# EasyEDA Pro project MasterCtrl.eprj, board MasterPCB_RA
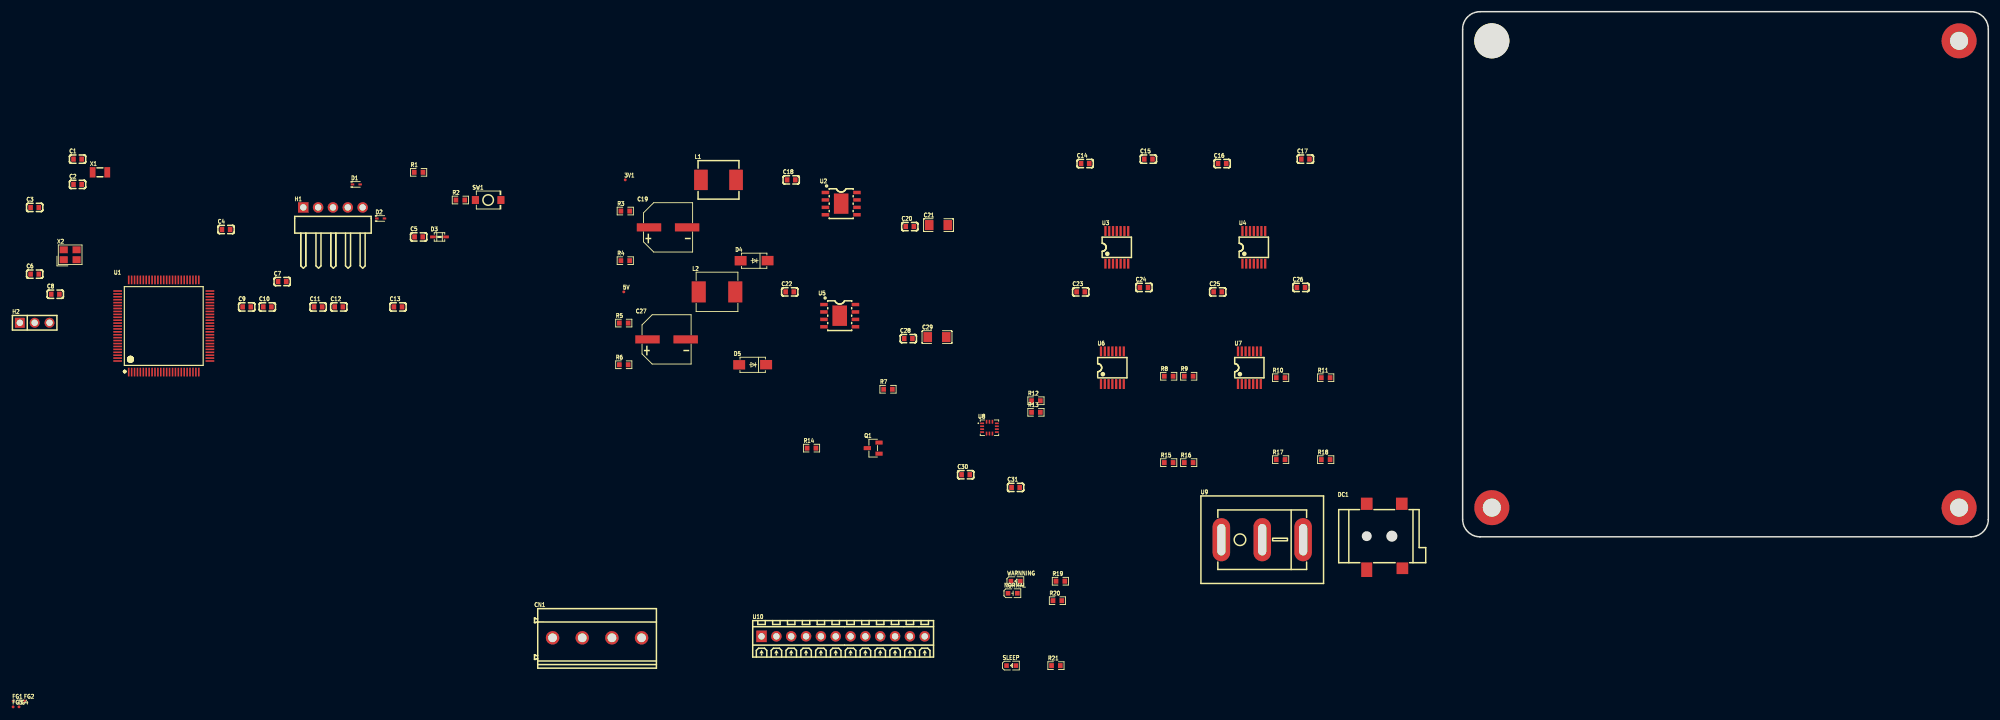
[diagram p10: board, top side]
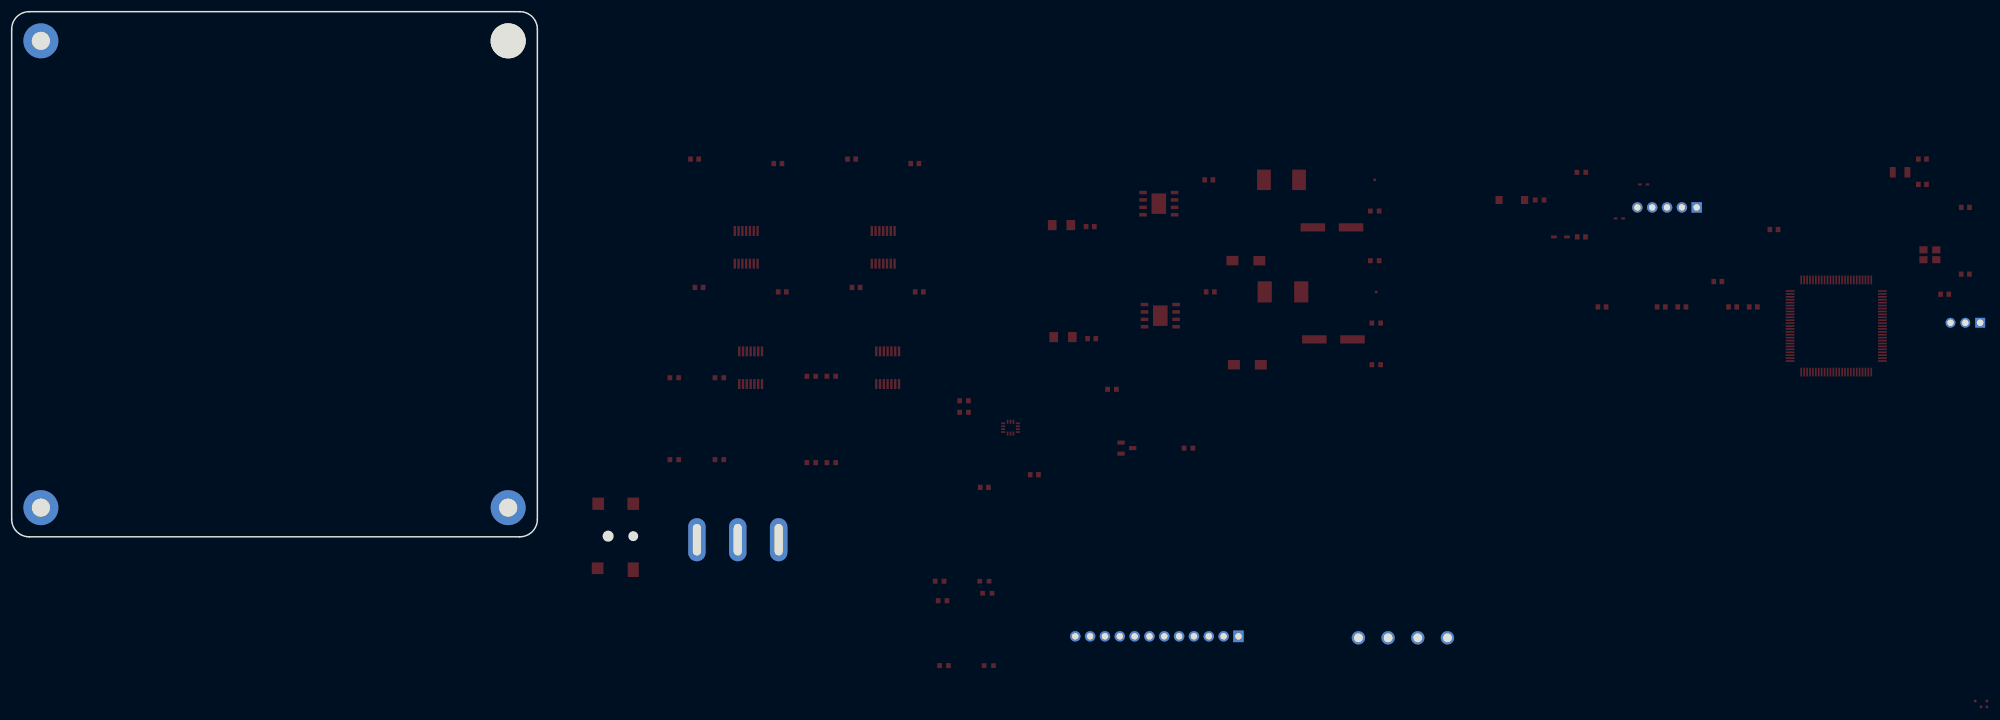
[diagram p11: board, bottom side, seen from below]

Outline 107.26 x 90.83 mm; copper layers: Top Layer, Bottom Layer. Coordinates in mm from the lower left corner of the outline.
Outline path: 17.26,87.83 17.26,3.83 arc(18.14,1.71) 20.26,0.83 104.26,0.83 arc(106.38,1.71) 107.26,3.83 107.26,87.83 arc(106.38,89.95) 104.26,90.83 20.26,90.83 arc(18.14,89.95) 17.26,87.83
Stack: Top Layer 0.035mm / Dielectric1 1.51mm FR4 er 4.5 / Bottom Layer 0.035mm

## Design rules (mm)
template: JLCPCB Capability(Two Layers Board)
spacing copperThickness1oz (default): track to track 0.102, other pairs 0.152 to 0.3
spacing copperThickness2oz: track to track 0.203, other pairs 0.152 to 0.3
track width copperThickness1oz (default): min 0.127, default 0.254, max 2.54
track width copperThickness2oz: min 0.203, default 0.254, max 2.54
differential pair differentialPair (default): width min 0.127, default 0.254, max 2.54; gap min 0.152, default 0.152
via viaSize (default): diameter min 0.5, default 0.61, max 10; hole min 0.3, default 0.305, max 6.3

## Placement (name value [footprint] x y rotation side)
3V1  -  [Test-Point-0.5mm]  -126.1 62.01 0 top
5V  -  [Test-Point-0.5mm]  -126.35 42.81 0 top
C1  20pF  [C0603]  -219.87 65.56 0 top
C2  20pF  [C0603]  -219.87 61.23 0 top
C3  20pF  [C0603]  -227.21 57.28 0 top
C4  100nF  [C0603]  -194.45 53.5 0 top
C5  1uF  [C0603]  -161.48 52.23 0 top
C6  20pF  [C0603]  -227.21 45.85 0 top
C7  100nF  [C0603]  -184.84 44.58 0 top
C8  100nF  [C0603]  -223.68 42.41 0 top
C9  100nF  [C0603]  -190.91 40.23 0 top
C10  100nF  [C0603]  -187.38 40.23 0 top
C11  100nF  [C0603]  -178.68 40.23 0 top
C12  100nF  [C0603]  -175.15 40.23 0 top
C13  10uF  [C0603]  -165.01 40.23 0 top
C14  100nF  [C0603]  -47.36 64.8 0 top
C15  100nF  [C0603]  -36.54 65.56 0 top
C16  100nF  [C0603]  -23.91 64.8 0 top
C17  100nF  [C0603]  -9.66 65.56 0 top
C18  10nF  [C0603]  -97.69 62.01 0 top
C19  220uF  [CAP-SMD_BD8.0-L8.3-W8.3-FD]  -118.77 53.87 0 top
C20  100nF  [C0603]  -77.38 54 0 top
C21  10uF  [C1206]  -72.47 54.25 0 top
C22  10nF  [C0603]  -97.94 42.81 0 top
C23  100nF  [C0603]  -48.13 42.81 0 top
C24  100nF  [C0603]  -37.3 43.57 0 top
C25  100nF  [C0603]  -24.67 42.81 0 top
C26  100nF  [C0603]  -10.42 43.57 0 top
C27  220uF  [CAP-SMD_BD8.0-L8.3-W8.3-FD]  -119.03 34.67 0 top
C28  100nF  [C0603]  -77.64 34.8 0 top
C29  10uF  [C1206]  -72.73 35.06 0 top
C30  100nF  [C0603]  -67.82 11.48 0 top
C31  100nF  [C0603]  -59.27 9.3 0 top
CN1  DB128V-5.08-4P-GN-S  [CONN-TH_4P-P5.08_DIBO_DB128V-5.08]  -130.93 -16.48 0 top
D1  RB521S30T1G  [SOD-523_L1.2-W0.8-LS1.6-RD]  -172.14 61.23 0 top
D2  RB521S30T1G  [SOD-523_L1.2-W0.8-LS1.6-RD]  -167.98 55.39 0 top
D3  PESD3V3L1BA-N  [SOD-323_L1.8-W1.3-LS2.5-BI]  -157.9 52.23 0 top
D4  SS54  [SMA_L4.3-W2.6-LS5.0-FD]  -104.04 48.16 0 top
D5  SS54  [SMA_L4.3-W2.6-LS5.0-FD]  -104.29 30.32 0 top
DC1  DC050-T  [DC-IN_DC050-T]  3.9 0.85 0 top
FG1  -  [Test-Point-0.5mm]  -230.9 -27.31 0 top
FG2  -  [Test-Point-0.5mm]  -228.9 -27.31 0 top
FG3  -  [Test-Point-0.5mm]  -230.9 -28.31 0 top
FG4  -  [Test-Point-0.5mm]  -229.9 -28.31 0 top
H1  PZ254R-11-05P  [HDR-TH_5P-P2.54-H-M-W10.4]  -176.14 57.28 0 top
H2  PZ254V-11-03P  [HDR-TH_3P-P2.54-V-M]  -227.21 37.52 0 top
L1  10uH  [IND-SMD_L7.3-W6.8]  -110.14 62.01 0 top
L2  15uH  [IND-SMD_L7.0-W6.6_FXL0630]  -110.39 42.81 0 top
NOREF  -  [Pad_e86]  102.26 85.83 0 top
NOREF#2  -  [Pad_e87]  22.26 5.83 0 top
NOREF#3  -  [Pad_e83]  22.26 85.83 0 top
NOREF#4  -  [Pad_e88]  102.26 5.83 0 top
NORMAL  NCD0603G1  [LED0603-RD_1]  -59.77 -8.84 0 top
Q1  SS8050  [SOT-23-3_L2.9-W1.3-P1.90-LS2.4-BR]  -83.66 16.03 0 top
R1  4.7kΩ  [R0603]  -161.48 63.3 0 top
R2  0Ω  [R0603]  -154.33 58.55 0 top
R3  10K  [R0603]  -126.1 56.66 0 top
R4  5.9kΩ  [R0603]  -126.1 48.16 0 top
R5  10K  [R0603]  -126.35 37.46 0 top
R6  3.24kΩ  [R0603]  -126.35 30.32 0 top
R7  10K  [R0603]  -81.12 26.12 0 top
R8  1K  [R0603]  -33.06 28.35 0 top
R9  1.5K  [R0603]  -29.64 28.35 0 top
R10  1K  [R0603]  -13.9 28.1 0 top
R11  1.5K  [R0603]  -6.18 28.1 0 top
R12  4.7kΩ  [R0603]  -55.79 24.15 0 top
R13  4.7kΩ  [R0603]  -55.79 22.18 0 top
R14  1K  [R0603]  -94.21 16.03 0 top
R15  1K  [R0603]  -33.06 13.55 0 top
R16  1.5K  [R0603]  -29.64 13.55 0 top
R17  1K  [R0603]  -13.9 14.06 0 top
R18  1.5K  [R0603]  -6.18 14.06 0 top
R19  510  [R0603]  -51.6 -6.77 0 top
R20  510  [R0603]  -52.11 -10.11 0 top
R21  510  [R0603]  -52.37 -21.24 0 top
SLEEP  MHT192WDT-ICE  [LED0603-RD]  -60.03 -21.24 0 top
SW1  TS-1088-AR02016  [SW-SMD_L3.9-W3.0-P4.45]  -149.57 58.55 0 top
U1  R7FA4M2AD3CFP#AA0  [QFP-100_L14.0-W14.0-P0.50-LS16.0-BL]  -205.11 36.96 0 top
U2  TPS5430DDAR  [ESOP-8_L4.9-W3.9-P1.27-LS6.0-TL-EP]  -89.13 57.93 0 top
U3  RS0104YQ  [TSSOP-14_L5.0-W4.4-P0.65-LS6.4-BL]  -41.94 50.44 0 top
U4  RS0104YQ  [TSSOP-14_L5.0-W4.4-P0.65-LS6.4-BL]  -18.48 50.44 0 top
U5  TPS5430DDAR  [ESOP-8_L4.9-W3.9-P1.27-LS6.0-TL-EP]  -89.39 38.73 0 top
U6  RS0104YQ  [TSSOP-14_L5.0-W4.4-P0.65-LS6.4-BL]  -42.7 29.82 0 top
U7  RS0104YQ  [TSSOP-14_L5.0-W4.4-P0.65-LS6.4-BL]  -19.25 29.82 0 top
U8  ICM-42688P-HXY  [LGA-14_L3.0-W2.5-P0.50-TL]  -63.74 19.54 0 top
U9  RS601-1020011BB  [SW-TH_RS601-1020011BB]  -17.05 0.34 0 top
U10  MX128-2.54-12P-GN01-Cu-Y-A  [CONN-TH_12P-P2.54_MX128-2.54-12P-GN01-CU-Y-A]  -88.8 -16.22 0 top
WARNNING  NCD0603Y2  [LED0603-RD]  -59.27 -6.77 0 top
X1  32.768kHz  [FC-135R_L3.2-W1.5]  -216.04 63.3 0 top
X2  12MHz  [CRYSTAL-SMD_4P-L3.2-W2.5-BL]  -221.14 49.17 0 top

## Footprints (pads in the part's own frame, mm; a bottom-side part is the same pattern mirrored in y, then rotated)
C0603
  rect 0.8x0.9 smd: 1(-0.7,0) 2(0.7,0)
C1206
  rect 1.485x1.728 smd: 1(-1.593,0) 2(1.593,0)
CAP-SMD_BD8.0-L8.3-W8.3-FD
  rect 4.2x1.4 smd: 1(-3.267,0) 2(3.267,0)
CONN-TH_4P-P5.08_DIBO_DB128V-5.08
  round 2.3 hole 1.5: 1(-7.62,0) 2(-2.54,0) 3(2.54,0) 4(7.62,0)
CONN-TH_12P-P2.54_MX128-2.54-12P-GN01-CU-Y-A
  rect 1.8x2 hole 1.1: 1(-13.97,0)
  round 1.8 hole 1.1: 2(-11.43,0) 3(-8.89,0) 4(-6.35,0) 5(-3.81,0) 6(-1.27,0) 7(1.27,0) 8(3.81,0) 9(6.35,0) 10(8.89,0) 11(11.43,0) 12(13.97,0)
CRYSTAL-SMD_4P-L3.2-W2.5-BL
  rect 1.4x1.2 smd: 1(-1.1,-0.85) 2(1.1,-0.85) 3(1.1,0.85) 4(-1.1,0.85)
DC-IN_DC050-T
  rect 2x2.1 smd: 1(-3.05,5.65) 1(2.95,5.65)
  rect 1.9x2.5 smd: 2(-3.05,-5.65)
  rect 2x2 smd: 3(3.05,-5.4)
ESOP-8_L4.9-W3.9-P1.27-LS6.0-TL-EP
  rect 1.3x0.6 smd: 1(-2.7,1.905) 2(-2.7,0.635) 3(-2.7,-0.635) 4(-2.7,-1.905) 5(2.7,-1.905) 6(2.7,-0.635) 7(2.7,0.635) 8(2.7,1.905)
  rect 2.5x3.5 smd: 9(0,0)
FC-135R_L3.2-W1.5
  rect 1x1.8 smd: 1(-1.25,0) 2(1.25,0)
HDR-TH_3P-P2.54-V-M
  rect 1.7x1.7 hole 1.1: 1(-2.54,0)
  round 1.7 hole 1.1: 2(0,0) 3(2.54,0)
HDR-TH_5P-P2.54-H-M-W10.4
  rect 1.8x1.8 hole 1.1: 1(-5.08,0)
  round 1.8 hole 1.1: 2(-2.54,0) 3(0,0) 4(2.54,0) 5(5.08,0)
IND-SMD_L7.0-W6.6_FXL0630
  rect 2.424x3.62 smd: 1(3.128,0) 2(-3.128,0)
IND-SMD_L7.3-W6.8
  rect 2.35x3.5 smd: 1(-3,0) 2(3,0)
LED0603-RD
  rect 0.8x0.8 smd: 1(-0.799,0) 2(0.799,0)
LED0603-RD_1
  rect 0.8x0.8 smd: 1(-0.799,-0.004) 2(0.799,0.004)
LGA-14_L3.0-W2.5-P0.50-TL
  rect 0.675x0.28 smd: 1(-1.262,0.75) 2(-1.262,0.25) 3(-1.262,-0.25) 4(-1.262,-0.75) 8(1.262,-0.75) 9(1.262,-0.25) 10(1.262,0.25) 11(1.262,0.75)
  rect 0.28x0.675 smd: 5(-0.5,-1.012) 6(0,-1.012) 7(0.5,-1.012) 12(0.5,1.012) 13(0,1.012) 14(-0.5,1.012)
Pad_e83
  round 6 hole 6x3.1: 1(0,0)
Pad_e86
  round 6 hole 3.1: 1(0,0)
Pad_e87
  round 6 hole 3.1: 1(0,0)
Pad_e88
  round 6 hole 3.1: 1(0,0)
QFP-100_L14.0-W14.0-P0.50-LS16.0-BL
  rect 0.28x1.5 smd: 1(-6,-7.9) 2(-5.5,-7.9) 3(-5,-7.9) 4(-4.5,-7.9) 5(-4,-7.9) 6(-3.5,-7.9) 7(-3,-7.9) 8(-2.5,-7.9) 9(-2,-7.9) 10(-1.5,-7.9) 11(-1,-7.9) 12(-0.5,-7.9) 13(0,-7.9) 14(0.5,-7.9) 15(1,-7.9) 16(1.5,-7.9) 17(2,-7.9) 18(2.5,-7.9) 19(3,-7.9) 20(3.5,-7.9) 21(4,-7.9) 22(4.5,-7.9) 23(5,-7.9) 24(5.5,-7.9) 25(6,-7.9) 51(6,7.9) 52(5.5,7.9) 53(5,7.9) 54(4.5,7.9) 55(4,7.9) 56(3.5,7.9) 57(3,7.9) 58(2.5,7.9) 59(2,7.9) 60(1.5,7.9) 61(1,7.9) 62(0.5,7.9) 63(0,7.9) 64(-0.5,7.9) 65(-1,7.9) 66(-1.5,7.9) 67(-2,7.9) 68(-2.5,7.9) 69(-3,7.9) 70(-3.5,7.9) 71(-4,7.9) 72(-4.5,7.9) 73(-5,7.9) 74(-5.5,7.9) 75(-6,7.9)
  rect 1.5x0.28 smd: 26(7.9,-6) 27(7.9,-5.5) 28(7.9,-5) 29(7.9,-4.5) 30(7.9,-4) 31(7.9,-3.5) 32(7.9,-3) 33(7.9,-2.5) 34(7.9,-2) 35(7.9,-1.5) 36(7.9,-1) 37(7.9,-0.5) 38(7.9,0) 39(7.9,0.5) 40(7.9,1) 41(7.9,1.5) 42(7.9,2) 43(7.9,2.5) 44(7.9,3) 45(7.9,3.5) 46(7.9,4) 47(7.9,4.5) 48(7.9,5) 49(7.9,5.5) 50(7.9,6) 76(-7.9,6) 77(-7.9,5.5) 78(-7.9,5) 79(-7.9,4.5) 80(-7.9,4) 81(-7.9,3.5) 82(-7.9,3) 83(-7.9,2.5) 84(-7.9,2) 85(-7.9,1.5) 86(-7.9,1) 87(-7.9,0.5) 88(-7.9,0) 89(-7.9,-0.5) 90(-7.9,-1) 91(-7.9,-1.5) 92(-7.9,-2) 93(-7.9,-2.5) 94(-7.9,-3) 95(-7.9,-3.5) 96(-7.9,-4) 97(-7.9,-4.5) 98(-7.9,-5) 99(-7.9,-5.5) 100(-7.9,-6)
R0603
  rect 0.806x0.864 smd: 1(-0.753,0) 2(0.753,0)
SMA_L4.3-W2.6-LS5.0-FD
  rect 2.046x1.62 smd: 1(-2.304,-0.009) 2(2.304,0.009)
SOD-323_L1.8-W1.3-LS2.5-BI
  rect 0.985x0.49 smd: 1(-1.117,0) 2(1.117,0)
SOD-523_L1.2-W0.8-LS1.6-RD
  rect 0.6x0.36 smd: 1(-0.65,0) 2(0.65,0)
SOT-23-3_L2.9-W1.3-P1.90-LS2.4-BR
  rect 1.25x0.7 smd: 1(1,-0.95) 2(1,0.95) 3(-1,0)
SW-SMD_L3.9-W3.0-P4.45
  rect 1.23x1.36 smd: 1(-2.185,0) 2(2.185,0)
SW-TH_RS601-1020011BB
  oval 3x7.4 hole 1.4x5.4: 1(-7,0) 2(0,0) 3(7,0)
Test-Point-0.5mm
  round 0.5 smd: 1(0,0)
TSSOP-14_L5.0-W4.4-P0.65-LS6.4-BL
  rect 0.4x1.7 smd: 1(-1.95,-2.8) 2(-1.3,-2.8) 3(-0.65,-2.8) 4(0,-2.8) 5(0.65,-2.8) 6(1.3,-2.8) 7(1.95,-2.8) 8(1.95,2.8) 9(1.3,2.8) 10(0.65,2.8) 11(0,2.8) 12(-0.65,2.8) 13(-1.3,2.8) 14(-1.95,2.8)

## Nets
As in the schematic.

Pads without a net: DC1 3; NOREF 1; NOREF#2 1; NOREF#3 1; NOREF#4 1; U1 1 2 3 4 5 6 7 8 12 16 17 18 19 20 21 22 23 24 25 27 28 30 31 32 33 34 35 36 37 40 41 42 43 44 47 48 49 52 53 54 55 56 57 58 59 60 61 64 65 66 67 68 69 70 71 72 73 74 75 76 77 78 79 80 81 84 85 86 92 93 94 95 96 97 98 99 100; U2 2 3 5; U3 4 6 9 11; U4 2 6 9 13; U5 2 3 5; U6 2 6 9 13; U7 2 6 9 13; U8 1 2 3 10 11; U9 3
